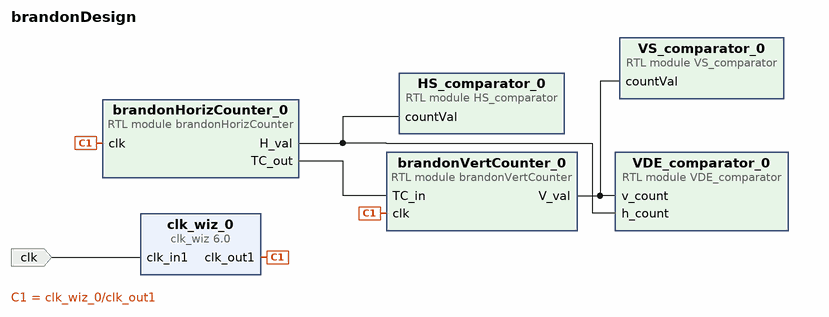
[diagram p0: block diagram of the top level]
# Vivado block design brandonDesign, xc7z007sclg400-1, Vivado 2021.1
create_bd_design brandonDesign

create_bd_port -dir I -type clk clk

create_bd_cell -type module -reference brandonHorizCounter brandonHorizCounter_0
create_bd_cell -type module -reference brandonVertCounter brandonVertCounter_0
create_bd_cell -type module -reference VS_comparator VS_comparator_0
create_bd_cell -type module -reference VDE_comparator VDE_comparator_0
create_bd_cell -type module -reference HS_comparator HS_comparator_0
create_bd_cell -type ip -vlnv xilinx.com:ip:clk_wiz:6.0 clk_wiz_0

# ---- connections ----

connect_bd_net [get_bd_pins brandonHorizCounter_0/H_val] [get_bd_pins VDE_comparator_0/h_count] [get_bd_pins HS_comparator_0/countVal]
connect_bd_net [get_bd_pins brandonHorizCounter_0/TC_out] [get_bd_pins brandonVertCounter_0/TC_in]
connect_bd_net [get_bd_pins brandonVertCounter_0/V_val] [get_bd_pins VDE_comparator_0/v_count] [get_bd_pins VS_comparator_0/countVal]
connect_bd_net -net clk_in1_0_1 [get_bd_ports clk] [get_bd_pins clk_wiz_0/clk_in1]
connect_bd_net [get_bd_pins clk_wiz_0/clk_out1] [get_bd_pins brandonHorizCounter_0/clk] [get_bd_pins brandonVertCounter_0/clk]

validate_bd_design
save_bd_design
